# EAGLE schematic micropet_v2 (EAGLE 6.4)

## Sheet 1 of 5: I/O
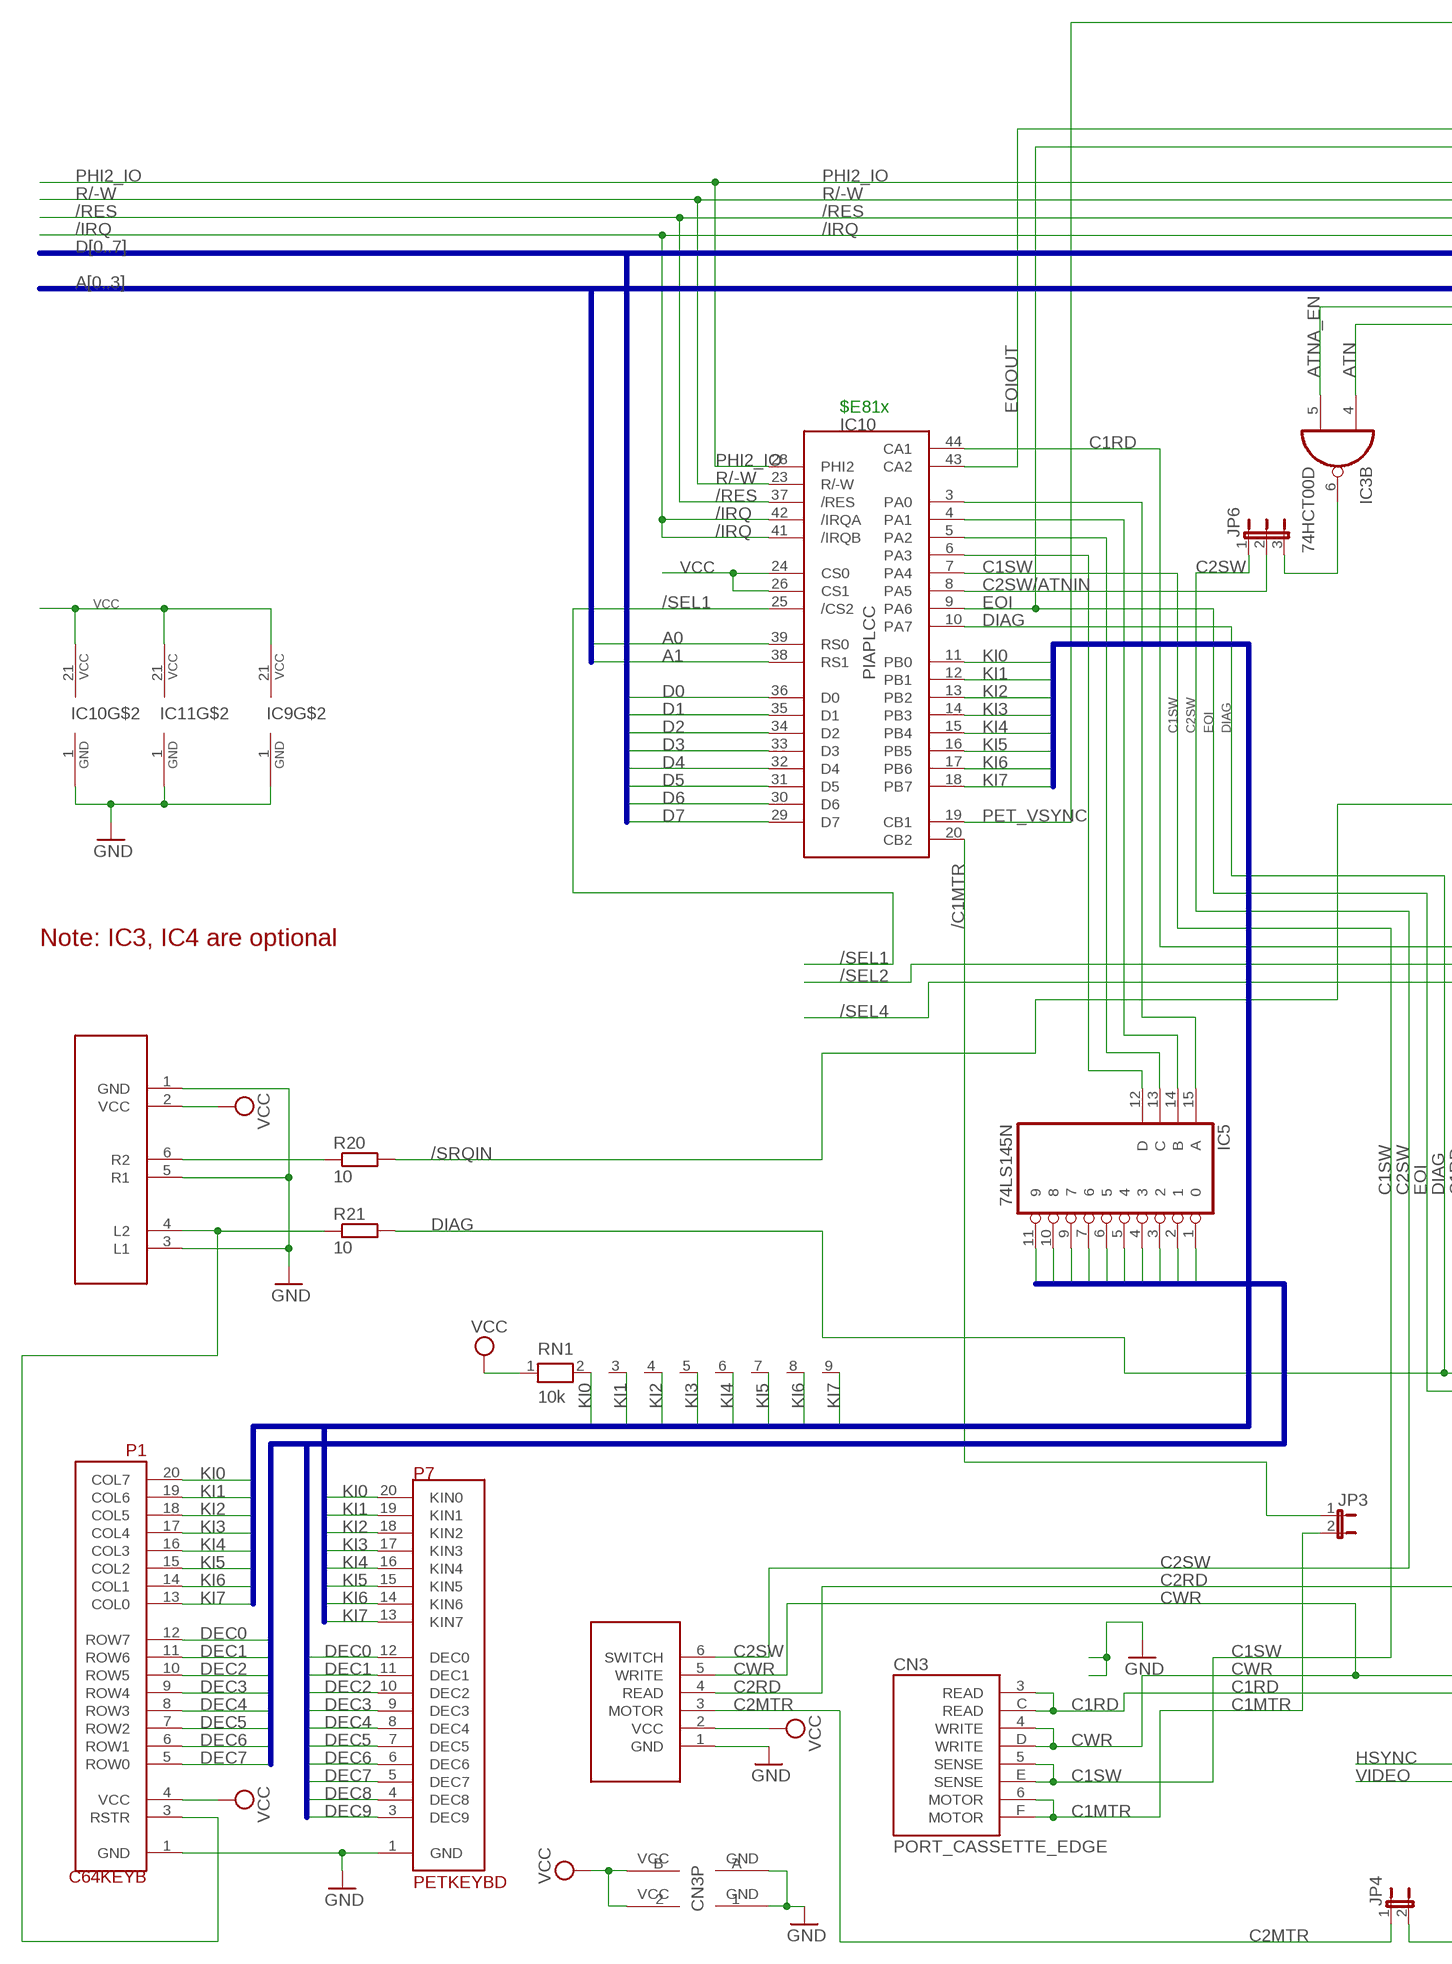
[diagram p0: schematic, sheet 1, part 1 of 2]
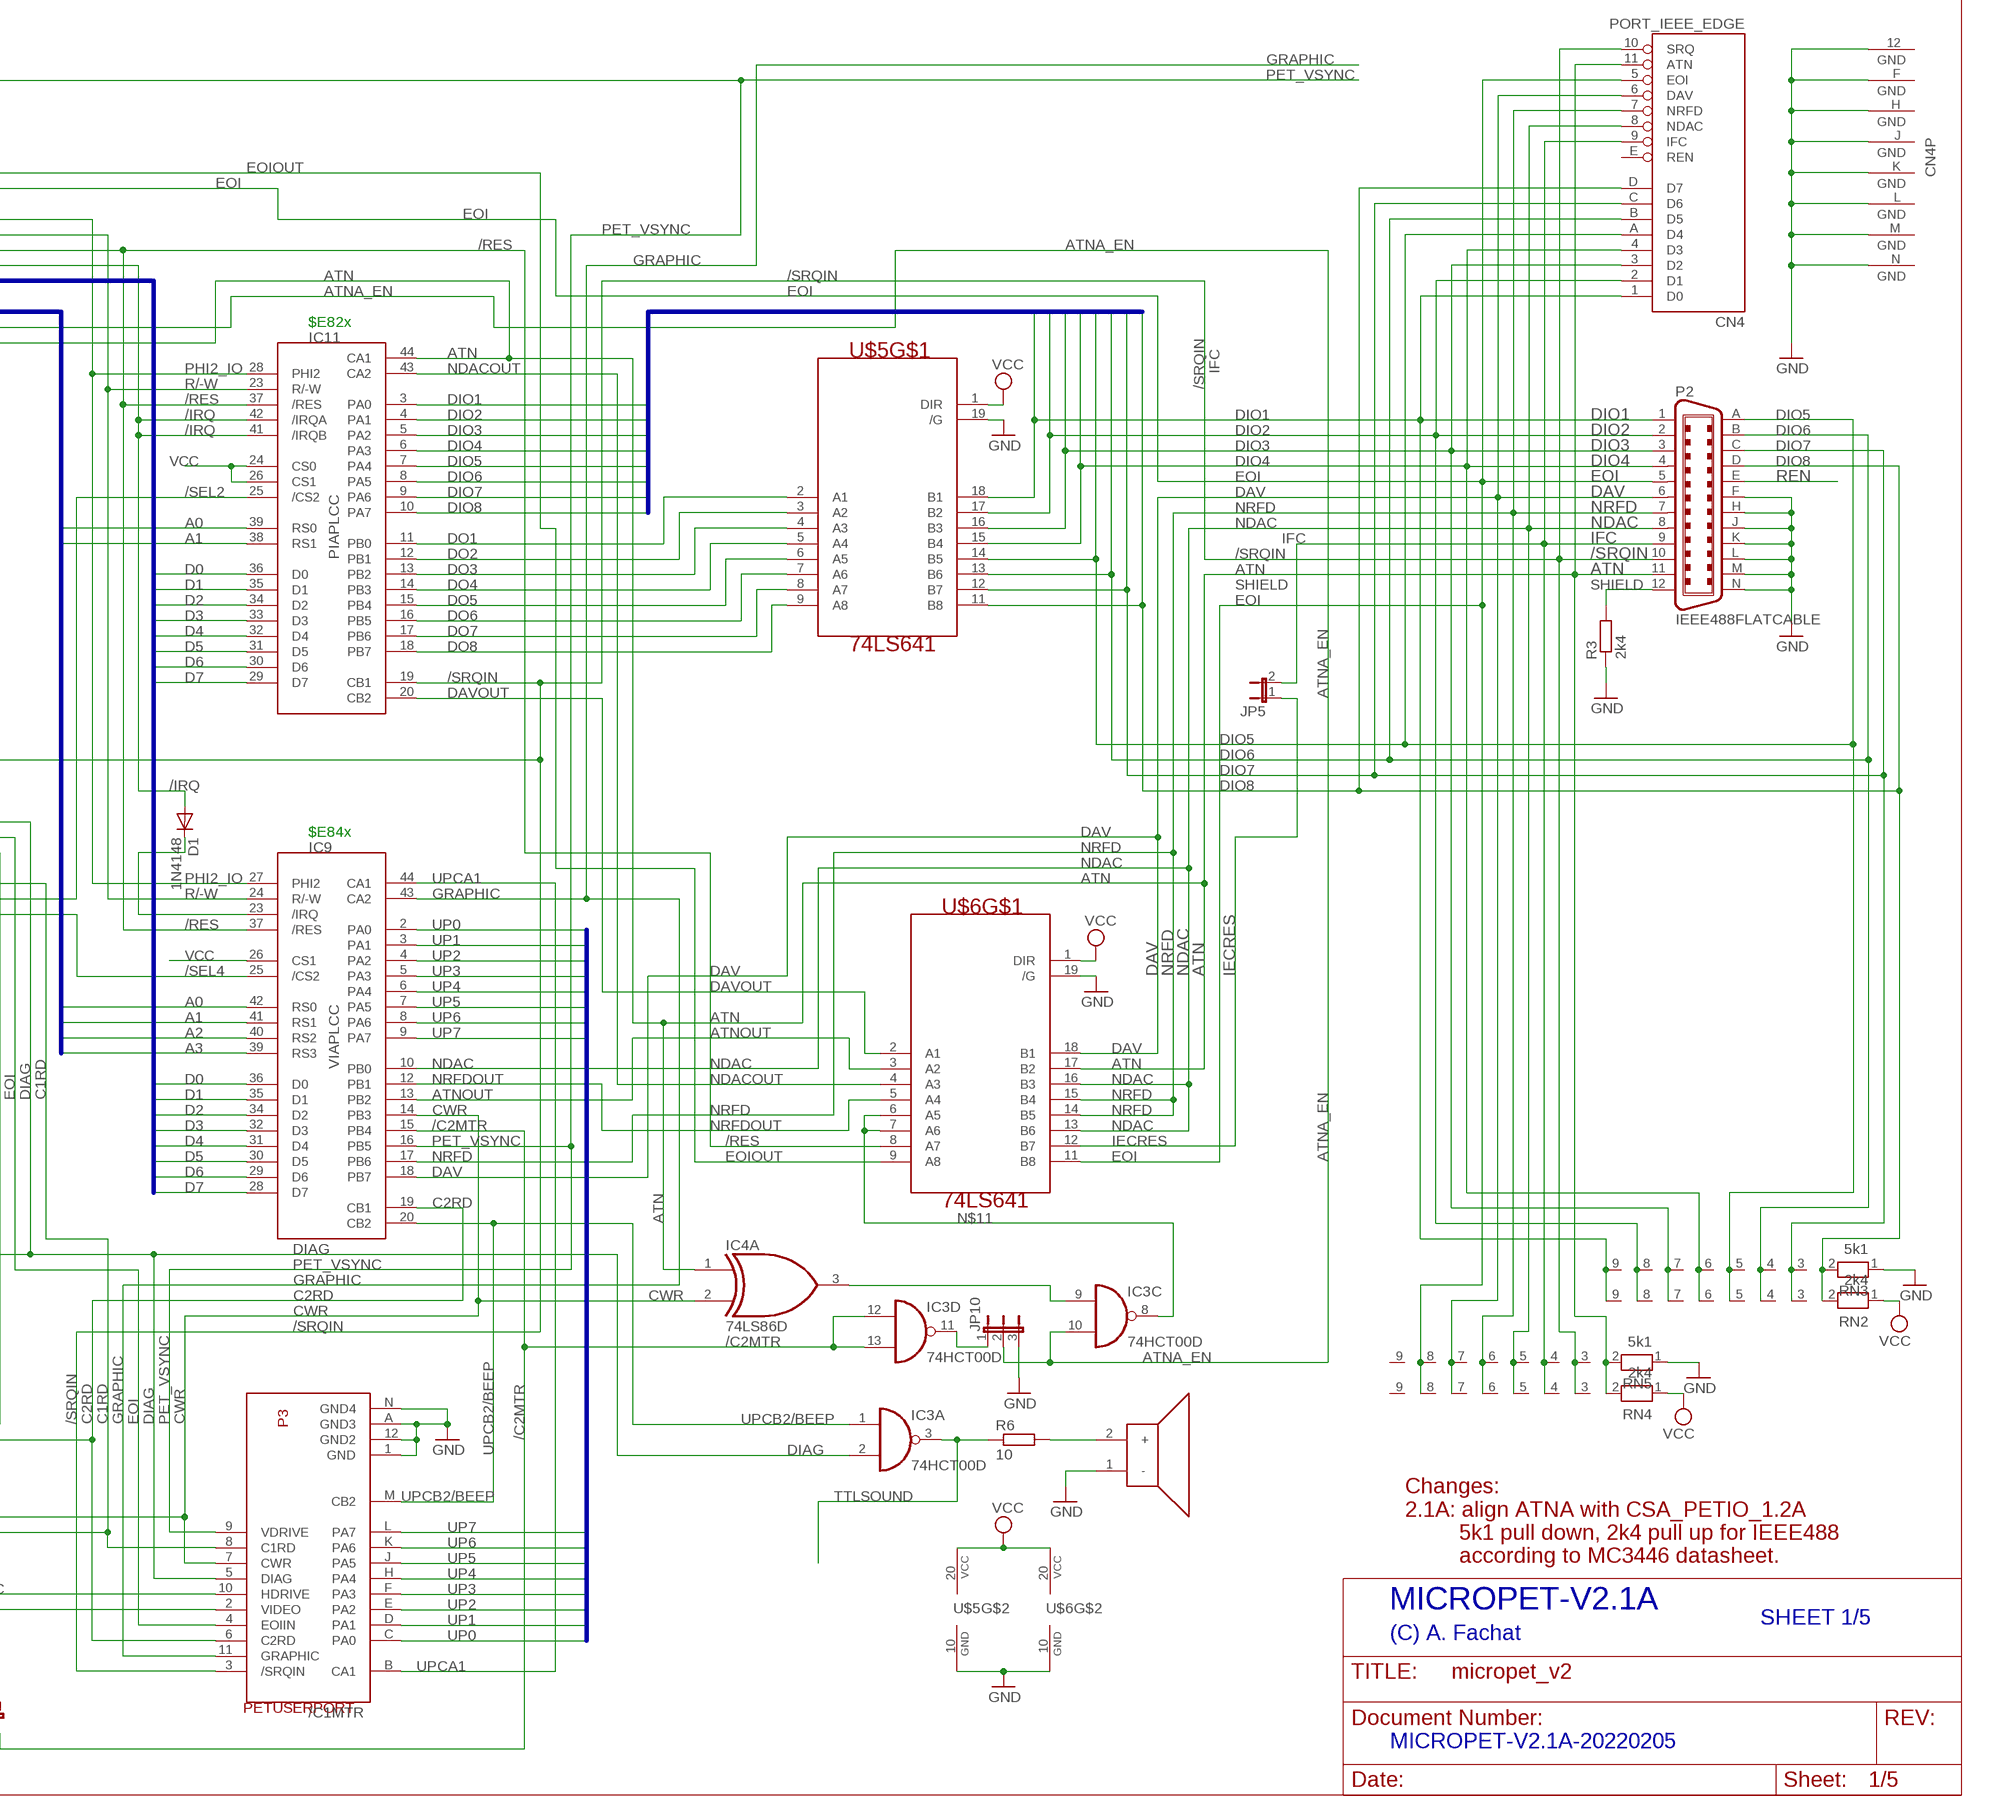
[diagram p1: schematic, sheet 1, part 2 of 2]

### Parts
BEEP1  PIEZOBEEPER  [JP2]
CN3  PORT_CASSETTE_EDGE  [MA156_6-2_KEYED]
CN4  PORT_IEEE_EDGE  [MA156_12-2_IEEE]
D1  1N4148  DIODE-D-5  [D-5]
IC3  74HCT00D  [SO14]
IC4  74LS86D  [SO14]
IC5  74LS145N  [DIL16]
IC9  VIAPLCC  [PLCC44]
IC10  PIAPLCC  [PLCC44]
IC11  PIAPLCC  [PLCC44]
JP3  JP1E  [JP1]
JP4  JP1E  [JP1]
JP5  JP1E  [JP1]
JP6  JP2E  [JP2]
JP10  JP2E  [JP2]
P1  C64KEYB  [C64KEYB]
P2  IEEE488FLATCABLE  [FLAT24]
P3  PETUSERPORT  [FLAT24]
P6  CBMTAPE  [JP6]
P7  PETKEYBD  [C64KEYB]
R3  2k4  R-EU_0207/2V  [0207/2V]
R6  10  R-EU_0207/2V  [0207/2V]
R20  10  R-EU_0207/2V  [0207/2V]
R21  10  R-EU_0207/2V  [0207/2V]
RN1  10k  RN08  [RN-9]
RN2  2k4  RN08  [RN-9]
RN3  5k1  RN08  [RN-9]
RN4  2k4  RN08  [RN-9]
RN5  5k1  RN08  [RN-9]
U$5  74LS641  [DIL20]
U$6  74LS641  [DIL20]
U$11  PETSKEY_EXTRA  [JP6]

### Nets
/C1MTR: IC10.20(CB2) JP3.1
/C2MTR: IC3.12(D:I0) IC3.13(D:I1) IC9.15(PB4) JP4.2
/IRQ: D1.A IC10.41(/IRQB) IC10.42(/IRQA) IC11.41(/IRQB) IC11.42(/IRQA) ; also sheet 2,5
/RES: IC9.37(/RES) IC10.37(/RES) IC11.37(/RES) U$6.8(A7) ; also sheet 2,3,4,5
/SEL1: IC10.25(/CS2) ; also sheet 2
/SEL2: IC11.25(/CS2) ; also sheet 2
/SEL4: IC9.25(/CS2) ; also sheet 2
/SRQIN: CN4.10(SRQ) IC11.19(CB1) P2.10 P3.3(/SRQIN) R20.2 RN4.3 RN5.3
A0: IC9.42(RS0) IC10.39(RS0) IC11.39(RS0) ; also sheet 2
A1: IC9.41(RS1) IC10.38(RS1) IC11.38(RS1) ; also sheet 2
A2: IC9.40(RS2) ; also sheet 2
A3: IC9.39(RS3) ; also sheet 2
ATN: CN4.11(ATN) IC3.4(B:I0) IC4.1(A:I0) IC11.44(CA1) P2.11 RN4.2 RN5.2 U$6.17(B2)
ATNA_EN: IC3.5(B:I1) IC3.10(C:I1) JP10.2
ATNOUT: IC9.13(PB2) U$6.3(A2)
C1MTR: CN3.6(MOTOR) CN3.F(MOTOR) JP3.2
C1RD: CN3.3(READ) CN3.C(READ) IC10.44(CA1) P3.8(C1RD)
C1SW: CN3.5(SENSE) CN3.E(SENSE) IC10.7(PA4)
C2MTR: JP4.1 P6.3(MOTOR)
C2RD: IC9.19(CB1) P3.6(C2RD) P6.4(READ)
C2SW: JP6.1 P6.6(SWITCH)
C2SW/ATNIN: IC10.8(PA5) JP6.2
CWR: CN3.4(WRITE) CN3.D(WRITE) IC4.2(A:I1) IC9.14(PB3) P3.7(CWR) P6.5(WRITE)
D0: IC9.36(D0) IC10.36(D0) IC11.36(D0) ; also sheet 2
D1: IC9.35(D1) IC10.35(D1) IC11.35(D1) ; also sheet 2
D2: IC9.34(D2) IC10.34(D2) IC11.34(D2) ; also sheet 2
D3: IC9.32(D3) IC10.33(D3) IC11.33(D3) ; also sheet 2
D4: IC9.31(D4) IC10.32(D4) IC11.32(D4) ; also sheet 2
D5: IC9.30(D5) IC10.31(D5) IC11.31(D5) ; also sheet 2
D6: IC9.29(D6) IC10.30(D6) IC11.30(D6) ; also sheet 2
D7: IC9.28(D7) IC10.29(D7) IC11.29(D7) ; also sheet 2
DAV: CN4.6(DAV) IC9.18(PB7) P2.6 RN4.7 RN5.7 U$6.18(B1)
DAVOUT: IC11.20(CB2) U$6.2(A1)
DEC0: IC5.1 P1.12(ROW7) P7.12(DEC0)
DEC1: IC5.2 P1.11(ROW6) P7.11(DEC1)
DEC2: IC5.3 P1.10(ROW5) P7.10(DEC2)
DEC3: IC5.4 P1.9(ROW4) P7.9(DEC3)
DEC4: IC5.5 P1.8(ROW3) P7.8(DEC4)
DEC5: IC5.6 P1.7(ROW2) P7.7(DEC5)
DEC6: IC5.7 P1.6(ROW1) P7.6(DEC6)
DEC7: IC5.9 P1.5(ROW0) P7.5(DEC7)
DEC8: IC5.10 P7.4(DEC8)
DEC9: IC5.11 P7.3(DEC9)
DIAG: IC3.2(A:I1) IC10.10(PA7) P3.5(DIAG) R21.2
DIO1: CN4.1(D0) IC11.3(PA0) P2.1 RN2.9 RN3.9 U$5.18(B1)
DIO2: CN4.2(D1) IC11.4(PA1) P2.2 RN2.8 RN3.8 U$5.17(B2)
DIO3: CN4.3(D2) IC11.5(PA2) P2.3 RN2.7 RN3.7 U$5.16(B3)
DIO4: CN4.4(D3) IC11.6(PA3) P2.4 RN2.6 RN3.6 U$5.15(B4)
DIO5: CN4.A(D4) IC11.7(PA4) P2.A RN2.5 RN3.5 U$5.14(B5)
DIO6: CN4.B(D5) IC11.8(PA5) P2.B RN2.4 RN3.4 U$5.13(B6)
DIO7: CN4.C(D6) IC11.9(PA6) P2.C RN2.3 RN3.3 U$5.12(B7)
DIO8: CN4.D(D7) IC11.10(PA7) P2.D RN2.2 RN3.2 U$5.11(B8)
DO1: IC11.11(PB0) U$5.2(A1)
DO2: IC11.12(PB1) U$5.3(A2)
DO3: IC11.13(PB2) U$5.4(A3)
DO4: IC11.14(PB3) U$5.5(A4)
DO5: IC11.15(PB4) U$5.6(A5)
DO6: IC11.16(PB5) U$5.7(A6)
DO7: IC11.17(PB6) U$5.8(A7)
DO8: IC11.18(PB7) U$5.9(A8)
EOI: CN4.5(EOI) IC10.9(PA6) P2.5 P3.4(EOIIN) RN4.8 RN5.8 U$6.11(B8)
EOIOUT: IC10.43(CA2) U$6.9(A8)
GND: BEEP1.1(-) CN3.1(GND) CN3.A(GND) CN4.12(GND) CN4.F(GND) CN4.H(GND) CN4.J(GND) CN4.K(GND) CN4.L(GND) CN4.M(GND) CN4.N(GND) IC9.1(GND) IC10.1(GND) IC11.1(GND) JP10.3 P1.1(GND) P2.F P2.H P2.J P2.K P2.L P2.M P2.N P3.1(GND) P3.12(GND2) P3.A(GND3) P3.N(GND4) P6.1(GND) P7.1(GND) R3.1 RN3.1 RN5.1 U$5.10(GND) U$5.19(/G) U$6.10(GND) U$6.19(/G) U$11.1(GND) U$11.3(L1) U$11.5(R1) ; also sheet 2,3,4,5
GRAPHIC: IC9.43(CA2) P3.11(GRAPHIC) ; also sheet 2
HSYNC: P3.10(HDRIVE) ; also sheet 2,4
IECRES: JP5.1 U$6.12(B7)
IFC: CN4.9(IFC) JP5.2 P2.9 RN4.4 RN5.4
KI0: IC10.11(PB0) P1.20(COL7) P7.20(KIN0) RN1.2
KI1: IC10.12(PB1) P1.19(COL6) P7.19(KIN1) RN1.3
KI2: IC10.13(PB2) P1.18(COL5) P7.18(KIN2) RN1.4
KI3: IC10.14(PB3) P1.17(COL4) P7.17(KIN3) RN1.5
KI4: IC10.15(PB4) P1.16(COL3) P7.16(KIN4) RN1.6
KI5: IC10.16(PB5) P1.15(COL2) P7.15(KIN5) RN1.7
KI6: IC10.17(PB6) P1.14(COL1) P7.14(KIN6) RN1.8
KI7: IC10.18(PB7) P1.13(COL0) P7.13(KIN7) RN1.9
N$1: IC3.9(C:I0) IC4.3(A:O)
N$2: IC3.11(D:O) JP10.1
N$4: BEEP1.2(+) R6.2
N$5: D1.C IC9.23(/IRQ)
N$11: IC3.8(C:O) U$6.6(A5) U$6.7(A6)
N$12: IC3.6(B:O) JP6.3
N$20: IC5.15(A) IC10.3(PA0)
N$21: IC5.14(B) IC10.4(PA1)
N$22: IC5.13(C) IC10.5(PA2)
N$23: IC5.12(D) IC10.6(PA3)
N$43: P1.3(RSTR) R21.1 U$11.4(L2)
N$45: R20.1 U$11.6(R2)
NDAC: CN4.8(NDAC) IC9.10(PB0) P2.8 RN4.5 RN5.5 U$6.13(B6) U$6.16(B3)
NDACOUT: IC11.43(CA2) U$6.4(A3)
NRFD: CN4.7(NRFD) IC9.17(PB6) P2.7 RN4.6 RN5.6 U$6.14(B5) U$6.15(B4)
NRFDOUT: IC9.12(PB1) U$6.5(A4)
PET_VSYNC: IC9.16(PB5) IC10.19(CB1) P3.9(VDRIVE) ; also sheet 2
PHI2_IO: IC9.27(PHI2) IC10.28(PHI2) IC11.28(PHI2) ; also sheet 2
R/-W: IC9.24(R/-W) IC10.23(R/-W) IC11.23(R/-W) ; also sheet 2
REN: P2.E
SHIELD: P2.12 R3.2
TTLSOUND: IC3.3(A:O) R6.1 ; also sheet 4
UP0: IC9.2(PA0) P3.C(PA0)
UP1: IC9.3(PA1) P3.D(PA1)
UP2: IC9.4(PA2) P3.E(PA2)
UP3: IC9.5(PA3) P3.F(PA3)
UP4: IC9.6(PA4) P3.H(PA4)
UP5: IC9.7(PA5) P3.J(PA5)
UP6: IC9.8(PA6) P3.K(PA6)
UP7: IC9.9(PA7) P3.L(PA7)
UPCA1: IC9.44(CA1) P3.B(CA1)
UPCB2/BEEP: IC3.1(A:I0) IC9.20(CB2) P3.M(CB2)
VCC: CN3.2(VCC) CN3.B(VCC) IC9.21(VCC) IC9.26(CS1) IC10.21(VCC) IC10.24(CS0) IC10.26(CS1) IC11.21(VCC) IC11.24(CS0) IC11.26(CS1) P1.4(VCC) P6.2(VCC) RN1.1 RN2.1 RN4.1 U$5.1(DIR) U$5.20(VCC) U$6.1(DIR) U$6.20(VCC) U$11.2(VCC) ; also sheet 2,3,4,5
VIDEO: P3.2(VIDEO) ; also sheet 2,4
Unconnected: CN4.E(REN) IC4.4(B:I0) IC4.5(B:I1) IC4.6(B:O) IC4.8(C:O) IC4.9(C:I0) IC4.10(C:I1) IC4.11(D:O) IC4.12(D:I0) IC4.13(D:I1) RN4.9 RN5.9

### Buses
D[0..7]
A[0..3]
KI[0..7]
UP[0..7]
DEC[0..9]
DIO[1..8]

### Notes on the sheet
- $E82x
- $E81x
- $E84x
- Note: IC3, IC4 are optional
- Changes:
  2.1A: align ATNA with CSA_PETIO_1.2A
           5k1 pull down, 2k4 pull up for IEEE488
           according to MC3446 datasheet.
- MICROPET-V2.1A
- SHEET 1/5
- (C) A. Fachat
- MICROPET-V2.1A-20220205

## Sheet 2 of 5: CPU,RAM,ROM
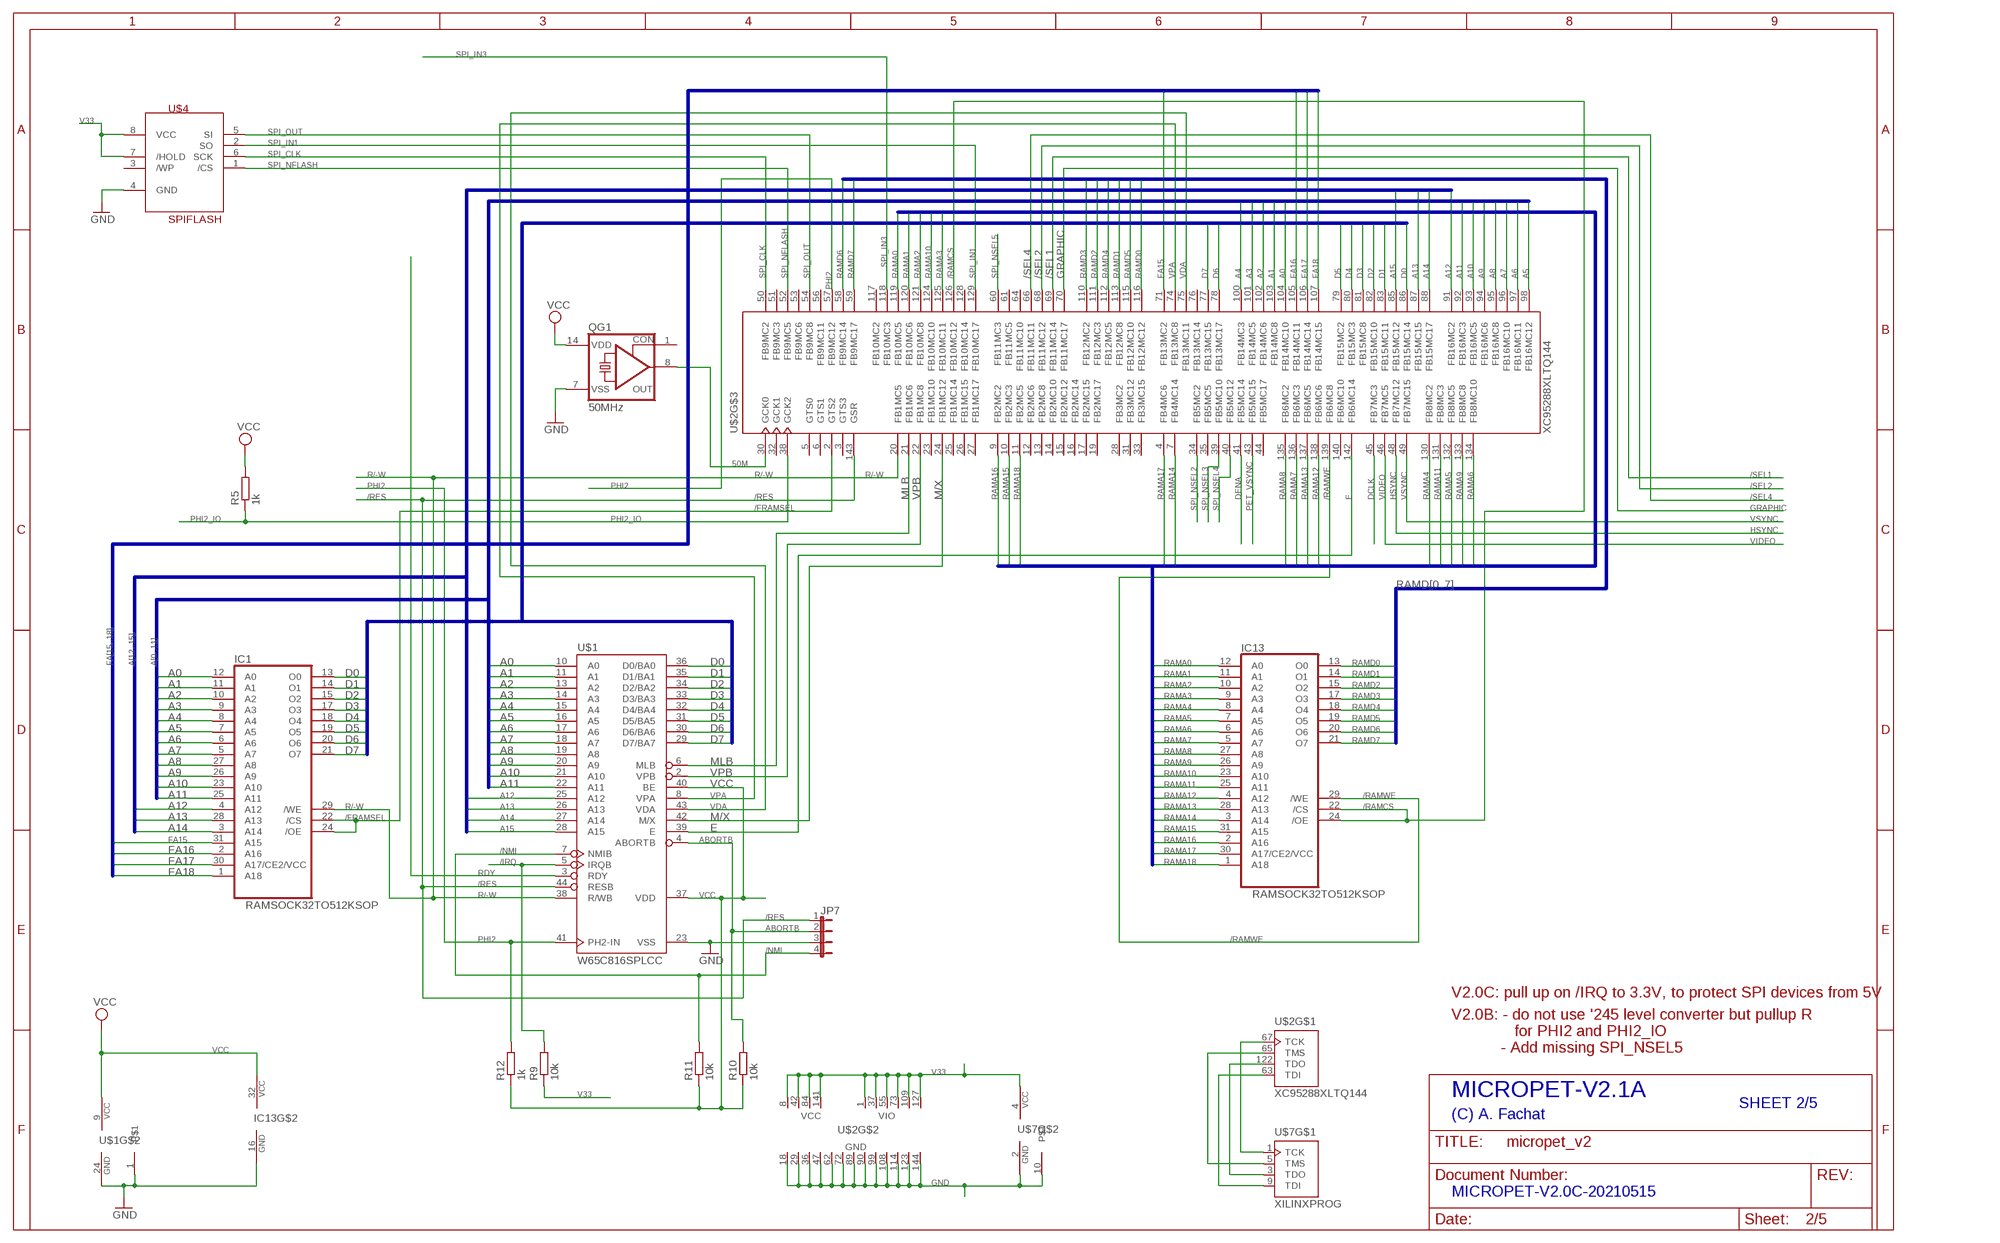
[diagram p2: schematic, sheet 2]

### Parts
IC1  RAMSOCK32TO512KSOP  [SOP32]
IC13  RAMSOCK32TO512KSOP  [SOP32]
JP7  JP4E  [JP4]
QG1  50MHz  CRYSTAL_RES-SG51  [SG51]
R5  1k  R-EU_0207/2V  [0207/2V]
R9  10k  R-EU_0207/2V  [0207/2V]
R10  10k  R-EU_0207/2V  [0207/2V]
R11  10k  R-EU_0207/2V  [0207/2V]
R12  1k  R-EU_0207/2V  [0207/2V]
U$1  W65C816SPLCC  [PLCC44]
U$2  XC95288XLTQ144  [TQFP144]
U$4  SPIFLASH  [DIL08]
U$7  XILINXPROG  [FLAT10BOX]

### Nets
50M: QG1.8(OUT) U$2.30(GCK0)
/FRAMSEL: IC1.22(/CS) IC1.24(/OE) U$2.2(GTS2)
/IRQ: R9.2 U$1.5(IRQB) ; also sheet 1,5
/NMI: JP7.4 R11.2 U$1.7(NMIB)
/RAMCS: IC13.22(/CS) IC13.24(/OE) U$2.126(FB10MC12)
/RAMWE: IC13.29(/WE) U$2.139(FB6MC8)
/RES: JP7.1 U$1.44(RESB) U$2.143(GSR) ; also sheet 1,3,4,5
/SEL1: U$2.69(FB11MC14) ; also sheet 1
/SEL2: U$2.68(FB11MC12) ; also sheet 1
/SEL4: U$2.66(FB11MC11) ; also sheet 1
A0: IC1.12(A0) U$1.10(A0) U$2.104(FB14MC10) ; also sheet 1
A1: IC1.11(A1) U$1.11(A1) U$2.103(FB14MC8) ; also sheet 1
A2: IC1.10(A2) U$1.13(A2) U$2.102(FB14MC6) ; also sheet 1
A3: IC1.9(A3) U$1.14(A3) U$2.101(FB14MC5) ; also sheet 1
A4: IC1.8(A4) U$1.15(A4) U$2.100(FB14MC3)
A5: IC1.7(A5) U$1.16(A5) U$2.98(FB16MC12)
A6: IC1.6(A6) U$1.17(A6) U$2.97(FB16MC11)
A7: IC1.5(A7) U$1.18(A7) U$2.96(FB16MC10)
A8: IC1.27(A8) U$1.19(A8) U$2.95(FB16MC8)
A9: IC1.26(A9) U$1.20(A9) U$2.94(FB16MC6)
A10: IC1.23(A10) U$1.21(A10) U$2.93(FB16MC5)
A11: IC1.25(A11) U$1.22(A11) U$2.92(FB16MC3)
A12: IC1.4(A12) U$1.25(A12) U$2.91(FB16MC2)
A13: IC1.28(A13) U$1.26(A13) U$2.87(FB15MC15)
A14: IC1.3(A14) U$1.27(A14) U$2.88(FB15MC17)
A15: U$1.28(A15) U$2.85(FB15MC12)
ABORTB: JP7.2 R10.2 U$1.4(ABORTB)
D0: IC1.13(O0) U$1.36(D0/BA0) U$2.86(FB15MC14) ; also sheet 1
D1: IC1.14(O1) U$1.35(D1/BA1) U$2.83(FB15MC11) ; also sheet 1
D2: IC1.15(O2) U$1.34(D2/BA2) U$2.82(FB15MC10) ; also sheet 1
D3: IC1.17(O3) U$1.33(D3/BA3) U$2.81(FB15MC8) ; also sheet 1
D4: IC1.18(O4) U$1.32(D4/BA4) U$2.80(FB15MC3) ; also sheet 1
D5: IC1.19(O5) U$1.31(D5/BA5) U$2.79(FB15MC2) ; also sheet 1
D6: IC1.20(O6) U$1.30(D6/BA6) U$2.78(FB13MC17) ; also sheet 1
D7: IC1.21(O7) U$1.29(D7/BA7) U$2.77(FB13MC15) ; also sheet 1
DCLK: U$2.45(FB7MC3) ; also sheet 4
DENA: U$2.41(FB5MC14) ; also sheet 4
E: U$1.39(E) U$2.142(FB6MC14)
FA15: IC1.31(A15) U$2.71(FB13MC2)
FA16: IC1.2(A16) U$2.105(FB14MC11)
FA17: IC1.30(A17/CE2/VCC) U$2.106(FB14MC14)
FA18: IC1.1(A18) U$2.107(FB14MC15)
GND: IC13.16(GND) JP7.3 QG1.7(VSS) U$1.1 U$1.23(VSS) U$1.24(GND) U$2.18(GND) U$2.29(GND) U$2.36(GND) U$2.47(GND) U$2.62(GND) U$2.72(GND) U$2.89(GND) U$2.90(GND) U$2.99(GND) U$2.108(GND) U$2.114(GND) U$2.123(GND) U$2.144(GND) U$4.4(GND) U$7.2(GND) U$7.10 ; also sheet 1,3,4,5
GRAPHIC: U$2.70(FB11MC17) ; also sheet 1
HSYNC: U$2.48(FB7MC12) ; also sheet 1,4
M/X: U$1.42(M/X) U$2.24(FB1MC12)
MLB: U$1.6(MLB) U$2.21(FB1MC6)
PET_VSYNC: U$2.43(FB5MC15) ; also sheet 1
PHI2: R12.2 U$1.41(PH2-IN) U$2.57(FB9MC12)
PHI2_IO: R5.1 U$2.38(GCK2) ; also sheet 1
R/-W: IC1.29(/WE) U$1.38(R/WB) U$2.20(FB1MC5) ; also sheet 1
RAMA0: IC13.12(A0) U$2.119(FB10MC5)
RAMA1: IC13.11(A1) U$2.120(FB10MC6)
RAMA2: IC13.10(A2) U$2.121(FB10MC8)
RAMA3: IC13.9(A3) U$2.125(FB10MC11)
RAMA4: IC13.8(A4) U$2.130(FB8MC2)
RAMA5: IC13.7(A5) U$2.132(FB8MC5)
RAMA6: IC13.6(A6) U$2.134(FB8MC10)
RAMA7: IC13.5(A7) U$2.136(FB6MC3)
RAMA8: IC13.27(A8) U$2.135(FB6MC2)
RAMA9: IC13.26(A9) U$2.133(FB8MC8)
RAMA10: IC13.23(A10) U$2.124(FB10MC10)
RAMA11: IC13.25(A11) U$2.131(FB8MC3)
RAMA12: IC13.4(A12) U$2.138(FB6MC6)
RAMA13: IC13.28(A13) U$2.137(FB6MC5)
RAMA14: IC13.3(A14) U$2.7(FB4MC14)
RAMA15: IC13.31(A15) U$2.10(FB2MC3)
RAMA16: IC13.2(A16) U$2.9(FB2MC2)
RAMA17: IC13.30(A17/CE2/VCC) U$2.4(FB4MC6)
RAMA18: IC13.1(A18) U$2.11(FB2MC5)
RAMD0: IC13.13(O0) U$2.116(FB12MC12)
RAMD1: IC13.14(O1) U$2.113(FB12MC8)
RAMD2: IC13.15(O2) U$2.111(FB12MC3)
RAMD3: IC13.17(O3) U$2.110(FB12MC2)
RAMD4: IC13.18(O4) U$2.112(FB12MC5)
RAMD5: IC13.19(O5) U$2.115(FB12MC10)
RAMD6: IC13.20(O6) U$2.58(FB9MC14)
RAMD7: IC13.21(O7) U$2.59(FB9MC17)
RDY: U$1.3(RDY)
SPI_CLK: U$2.50(FB9MC2) U$4.6(SCK) ; also sheet 5
SPI_IN1: U$2.129(FB10MC17) U$4.2(SO) ; also sheet 5
SPI_IN3: U$2.118(FB10MC3) ; also sheet 5
SPI_NFLASH: U$2.52(FB9MC5) U$4.1(/CS)
SPI_NSEL2: U$2.34(FB5MC2) ; also sheet 5
SPI_NSEL3: U$2.39(FB5MC10) ; also sheet 5
SPI_NSEL4: U$2.40(FB5MC12) ; also sheet 5
SPI_NSEL5: U$2.60(FB11MC3) ; also sheet 5
SPI_OUT: U$2.54(FB9MC8) U$4.5(SI) ; also sheet 5
TCK: U$2.67(TCK) U$7.1(TCK)
TDI: U$2.63(TDI) U$7.9(TDI)
TDO: U$2.122(TDO) U$7.3(TDO)
TMS: U$2.65(TMS) U$7.5(TMS)
V33: R9.1 U$2.1(VIO) U$2.8(VCC) U$2.37(VIO) U$2.42(VCC) U$2.55(VIO) U$2.73(VIO) U$2.84(VCC) U$2.109(VIO) U$2.127(VIO) U$2.141(VCC) U$4.7(/HOLD) U$4.8(VCC) U$7.4(VCC) ; also sheet 3,4,5
VCC: IC13.32(VCC) QG1.14(VDD) R5.2 R10.1 R11.1 R12.1 U$1.9(VCC) U$1.37(VDD) U$1.40(BE) ; also sheet 1,3,4,5
VDA: U$1.43(VDA) U$2.75(FB13MC11)
VIDEO: U$2.46(FB7MC5) ; also sheet 1,4
VPA: U$1.8(VPA) U$2.74(FB13MC8)
VPB: U$1.2(VPB) U$2.22(FB1MC8)
VSYNC: U$2.49(FB7MC15) ; also sheet 4
Unconnected: QG1.1(CON) U$2.3(GTS3) U$2.5(GTS0) U$2.6(GTS1) U$2.12(FB2MC6) U$2.13(FB2MC8) U$2.14(FB2MC10) U$2.15(FB2MC12) U$2.16(FB2MC14) U$2.17(FB2MC15) U$2.19(FB2MC17) U$2.23(FB1MC10) U$2.25(FB1MC14) U$2.26(FB1MC15) U$2.27(FB1MC17) U$2.28(FB3MC2) U$2.31(FB3MC12) U$2.32(GCK1) U$2.33(FB3MC15) U$2.35(FB5MC5) U$2.44(FB5MC17) U$2.51(FB9MC3) U$2.53(FB9MC6) U$2.56(FB9MC11) U$2.61(FB11MC5) U$2.64(FB11MC10) U$2.76(FB13MC14) U$2.117(FB10MC2) U$2.128(FB10MC14) U$2.140(FB6MC10) U$4.3(/WP)

### Buses
A[0..11]
D[0..7]
RAMD[0..7]
RAMA[0..18]
A[12..15]
FA[15..18]

### Notes on the sheet
- V2.0C: pull up on /IRQ to 3.3V, to protect SPI devices from 5V
- V2.0B: - do not use '245 level converter but pullup R 
                for PHI2 and PHI2_IO
             - Add missing SPI_NSEL5
- MICROPET-V2.1A
- SHEET 2/5
- (C) A. Fachat
- MICROPET-V2.0C-20210515

## Sheet 3 of 5: Power
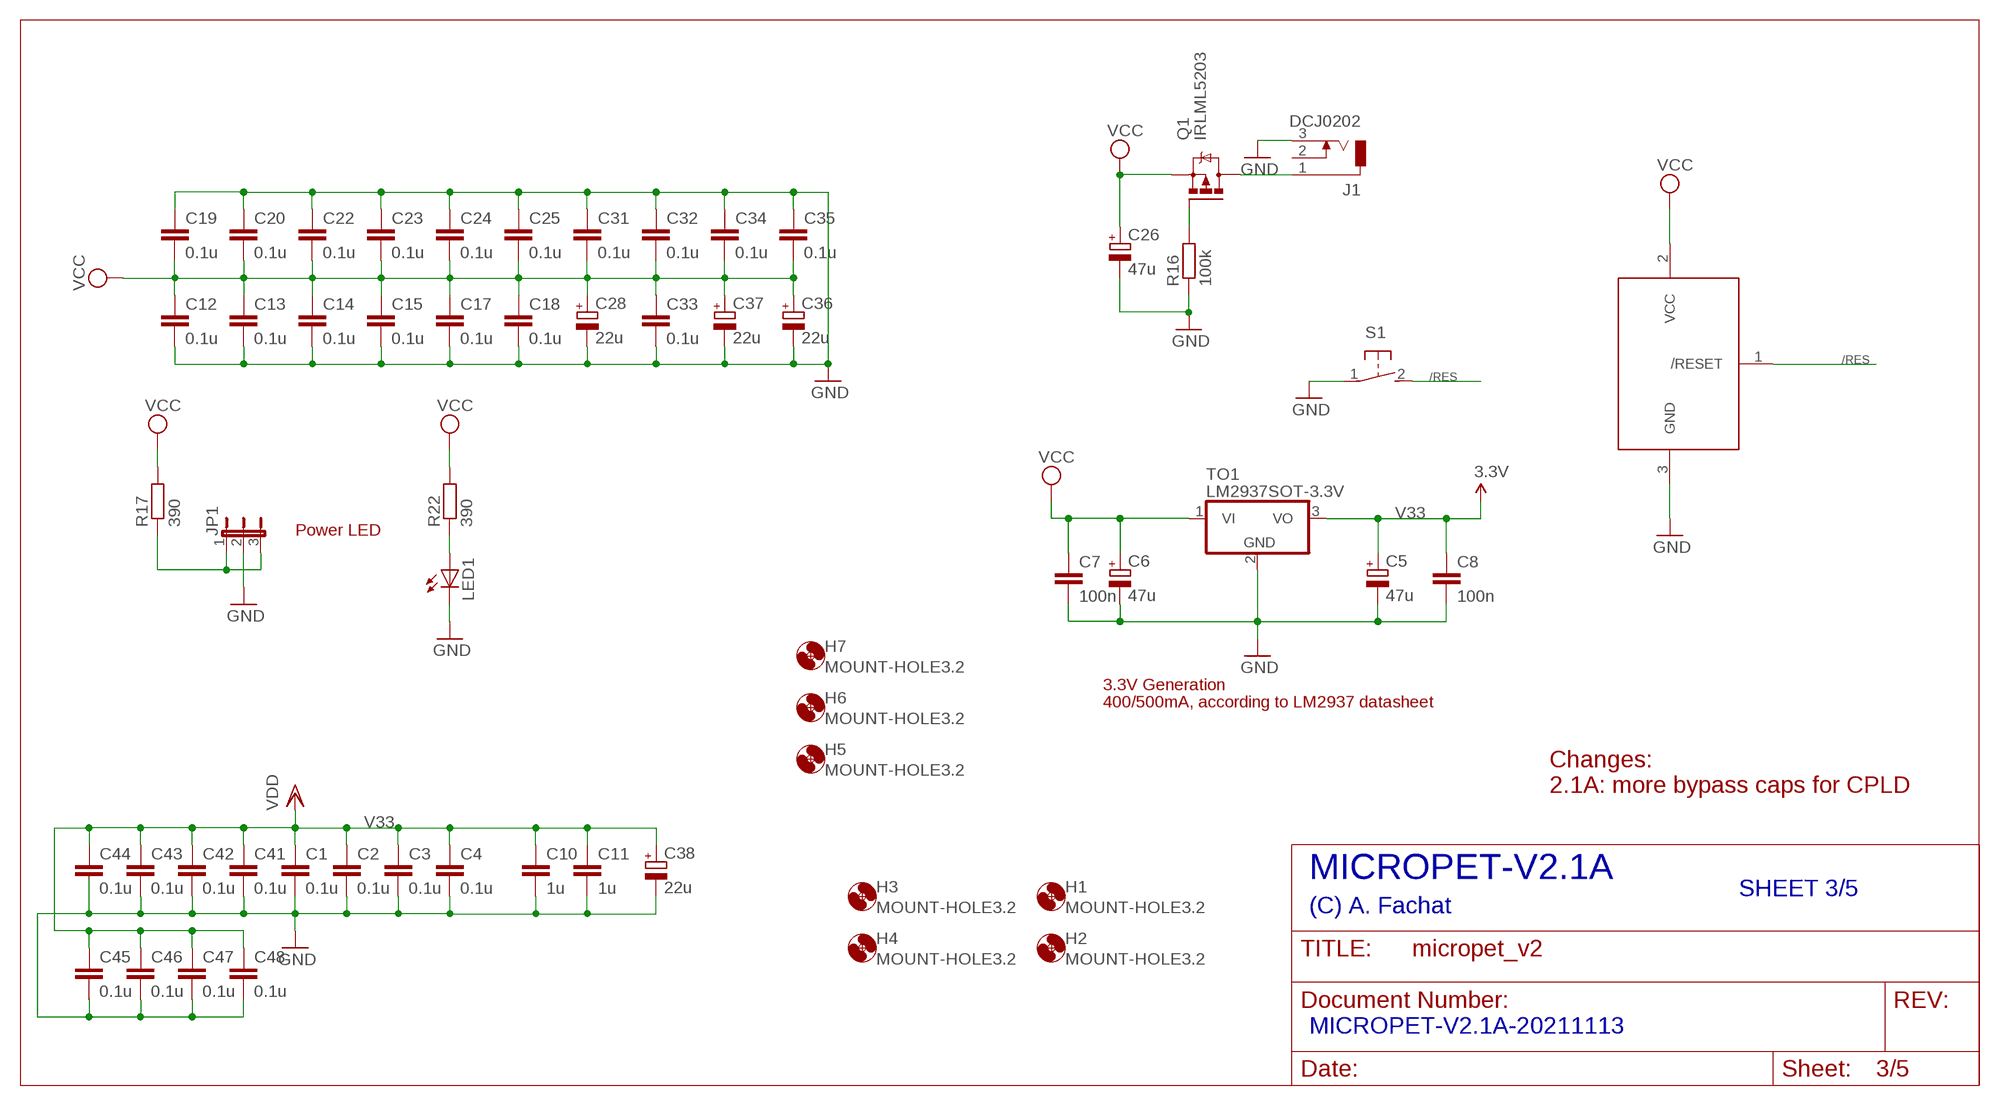
[diagram p3: schematic, sheet 3]

### Parts
C1  0.1u  C-EUC0603  [C0603]
C2  0.1u  C-EUC0603  [C0603]
C3  0.1u  C-EUC0603  [C0603]
C4  0.1u  C-EUC0603  [C0603]
C5  47u  CPOL-EUE5-8.5  [E5-8,5]
C6  47u  CPOL-EUE5-6  [E5-6]
C7  100n  C-EUC0603  [C0603]
C8  100n  C-EUC0603  [C0603]
C10  1u  C-EUC0603  [C0603]
C11  1u  C-EUC0603  [C0603]
C12  0.1u  C-EUC0603  [C0603]
C13  0.1u  C-EUC0603  [C0603]
C14  0.1u  C-EUC0603  [C0603]
C15  0.1u  C-EUC0603  [C0603]
C17  0.1u  C-EUC0603  [C0603]
C18  0.1u  C-EUC0603  [C0603]
C19  0.1u  C-EUC0603  [C0603]
C20  0.1u  C-EUC0603  [C0603]
C22  0.1u  C-EUC0603  [C0603]
C23  0.1u  C-EUC0603  [C0603]
C24  0.1u  C-EUC0603  [C0603]
C25  0.1u  C-EUC0603  [C0603]
C26  47u  CPOL-EUE2.5-6  [E2,5-6]
C28  22u  CPOL-EUE2.5-6  [E2,5-6]
C31  0.1u  C-EUC0603  [C0603]
C32  0.1u  C-EUC0603  [C0603]
C33  0.1u  C-EUC0603  [C0603]
C34  0.1u  C-EUC0603  [C0603]
C35  0.1u  C-EUC0603  [C0603]
C36  22u  CPOL-EUE2.5-6  [E2,5-6]
C37  22u  CPOL-EUE2.5-6  [E2,5-6]
C38  22u  CPOL-EUE2.5-6  [E2,5-6]
C41  0.1u  C-EUC0603  [C0603]
C42  0.1u  C-EUC0603  [C0603]
C43  0.1u  C-EUC0603  [C0603]
C44  0.1u  C-EUC0603  [C0603]
C45  0.1u  C-EUC0603  [C0603]
C46  0.1u  C-EUC0603  [C0603]
C47  0.1u  C-EUC0603  [C0603]
C48  0.1u  C-EUC0603  [C0603]
H1  MOUNT-HOLE3.2  [3,2]
H2  MOUNT-HOLE3.2  [3,2]
H3  MOUNT-HOLE3.2  [3,2]
H4  MOUNT-HOLE3.2  [3,2]
H5  MOUNT-HOLE3.2  [3,2]
H6  MOUNT-HOLE3.2  [3,2]
H7  MOUNT-HOLE3.2  [3,2]
J1  DCJ0202  [DCJ0202]
JP1  JP2E  [JP2]
LED1  LED3MM  [LED3MM]
Q1  IRLML5203  [MICRO3]
R16  100k  R-EU_0207/2V  [0207/2V]
R17  390  R-EU_0207/2V  [0207/2V]
R22  390  R-EU_0207/2V  [0207/2V]
S1  31-XX  [B3F-31XX]
TO1  LM2937SOT-3.3V  LM2937SOT  [SOT223]
U$3  DS1813  [TO92]

### Nets
/RES: S1.2(S) U$3.1(/RESET) ; also sheet 1,2,4,5
GND: C1.2 C2.2 C3.2 C4.2 C5.- C6.- C7.2 C8.2 C10.2 C11.2 C12.2 C13.2 C14.2 C15.2 C17.2 C18.2 C19.1 C20.1 C22.1 C23.1 C24.1 C25.1 C26.- C28.- C31.1 C32.1 C33.2 C34.1 C35.1 C36.- C37.- C38.- C41.2 C42.2 C43.2 C44.2 C45.2 C46.2 C47.2 C48.2 J1.3 JP1.2 LED1.K(C) R16.1 S1.1(P) TO1.2(GND) U$3.3(GND) ; also sheet 1,2,4,5
N$39: J1.1 Q1.3(D)
N$40: Q1.1(G) R16.2
N$41: JP1.1 JP1.3 R17.1
N$46: LED1.A R22.1
V33: C1.1 C2.1 C3.1 C4.1 C5.+ C8.1 C10.1 C11.1 C38.+ C41.1 C42.1 C43.1 C44.1 C45.1 C46.1 C47.1 C48.1 TO1.3(VO) ; supply symbol labelled VDD, 3.3V ; also sheet 2,4,5
VCC: C6.+ C7.1 C12.1 C13.1 C14.1 C15.1 C17.1 C18.1 C19.2 C20.2 C22.2 C23.2 C24.2 C25.2 C26.+ C28.+ C31.2 C32.2 C33.1 C34.2 C35.2 C36.+ C37.+ Q1.2(S) R17.2 R22.2 TO1.1(VI) U$3.2(VCC) ; also sheet 1,2,4,5
Unconnected: J1.2

### Notes on the sheet
- Power LED
- 3.3V Generation
- 400/500mA, according to LM2937 datasheet
- Changes:
  2.1A: more bypass caps for CPLD
- MICROPET-V2.1A
- SHEET 3/5
- (C) A. Fachat
- MICROPET-V2.1A-20211113

## Sheet 4 of 5: A/V Out
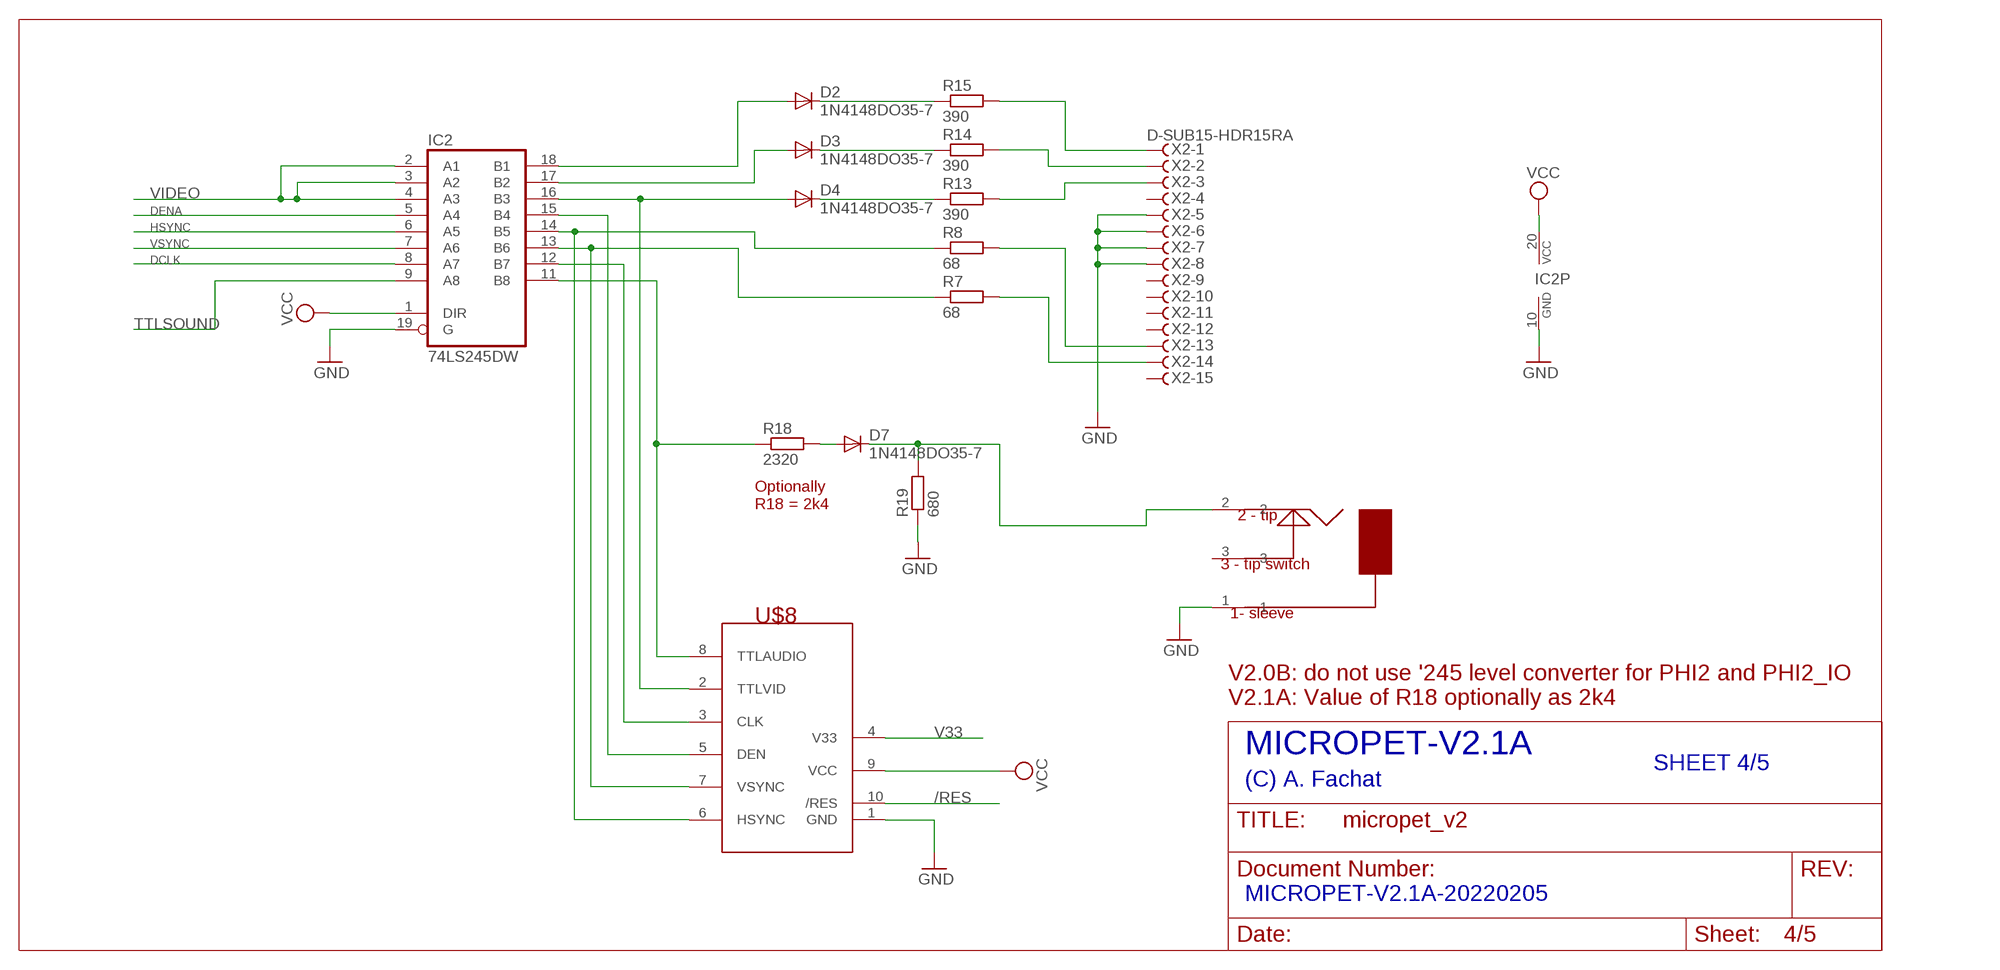
[diagram p4: schematic, sheet 4]

### Parts
D2  1N4148DO35-7  [DO35-7]
D3  1N4148DO35-7  [DO35-7]
D4  1N4148DO35-7  [DO35-7]
D7  1N4148DO35-7  [DO35-7]
IC2  74LS245DW  [SO20W]
R7  68  R-EU_0204/2V  [0204V]
R8  68  R-EU_0204/2V  [0204V]
R13  390  R-EU_0204/2V  [0204V]
R14  390  R-EU_0204/2V  [0204V]
R15  390  R-EU_0204/2V  [0204V]
R18  2320  R-EU_0204/2V  [0204V]
R19  680  R-EU_0204/2V  [0204V]
U$8  MONOVIDAUDIO  [FLAT10RIB]
U$10  MONOAUDIOB  [CUI_MJ-3502-B]
X2  D-SUB15-HDR15RA  [HDR15RA]

### Nets
/RES: U$8.10(/RES) ; also sheet 1,2,3,5
DCLK: IC2.8(A7) ; also sheet 2
DENA: IC2.5(A4) ; also sheet 2
GND: IC2.10(GND) IC2.19(G) R19.1 U$8.1(GND) U$10.1 X2.5 X2.6 X2.7 X2.8 ; also sheet 1,2,3,5
HSYNC: IC2.6(A5) ; also sheet 1,2
N$3: IC2.11(B8) R18.1 U$8.8(TTLAUDIO)
N$6: D2.A IC2.18(B1)
N$7: IC2.13(B6) R7.1 U$8.7(VSYNC)
N$14: IC2.12(B7) U$8.3(CLK)
N$17: R15.2 X2.1
N$18: R14.2 X2.2
N$19: R13.2 X2.3
N$24: R8.2 X2.13
N$25: R7.2 X2.14
N$26: IC2.14(B5) R8.1 U$8.6(HSYNC)
N$27: IC2.15(B4) U$8.5(DEN)
N$28: D4.A IC2.16(B3) U$8.2(TTLVID)
N$31: D2.C R15.1
N$32: D3.C R14.1
N$33: D4.C R13.1
N$42: D7.A R18.2
N$44: D7.C R19.2 U$10.2
N$50: D3.A IC2.17(B2)
TTLSOUND: IC2.9(A8) ; also sheet 1
V33: U$8.4(V33) ; also sheet 2,3,5
VCC: IC2.1(DIR) IC2.20(VCC) U$8.9(VCC) ; also sheet 1,2,3,5
VIDEO: IC2.2(A1) IC2.3(A2) IC2.4(A3) ; also sheet 1,2
VSYNC: IC2.7(A6) ; also sheet 2
Unconnected: U$10.3 X2.4 X2.9 X2.10 X2.11 X2.12 X2.15

### Notes on the sheet
- Optionally
  R18 = 2k4
- V2.0B: do not use '245 level converter for PHI2 and PHI2_IO
  V2.1A: Value of R18 optionally as 2k4
- MICROPET-V2.1A
- SHEET 4/5
- (C) A. Fachat
- MICROPET-V2.1A-20220205

## Sheet 5 of 5: USB
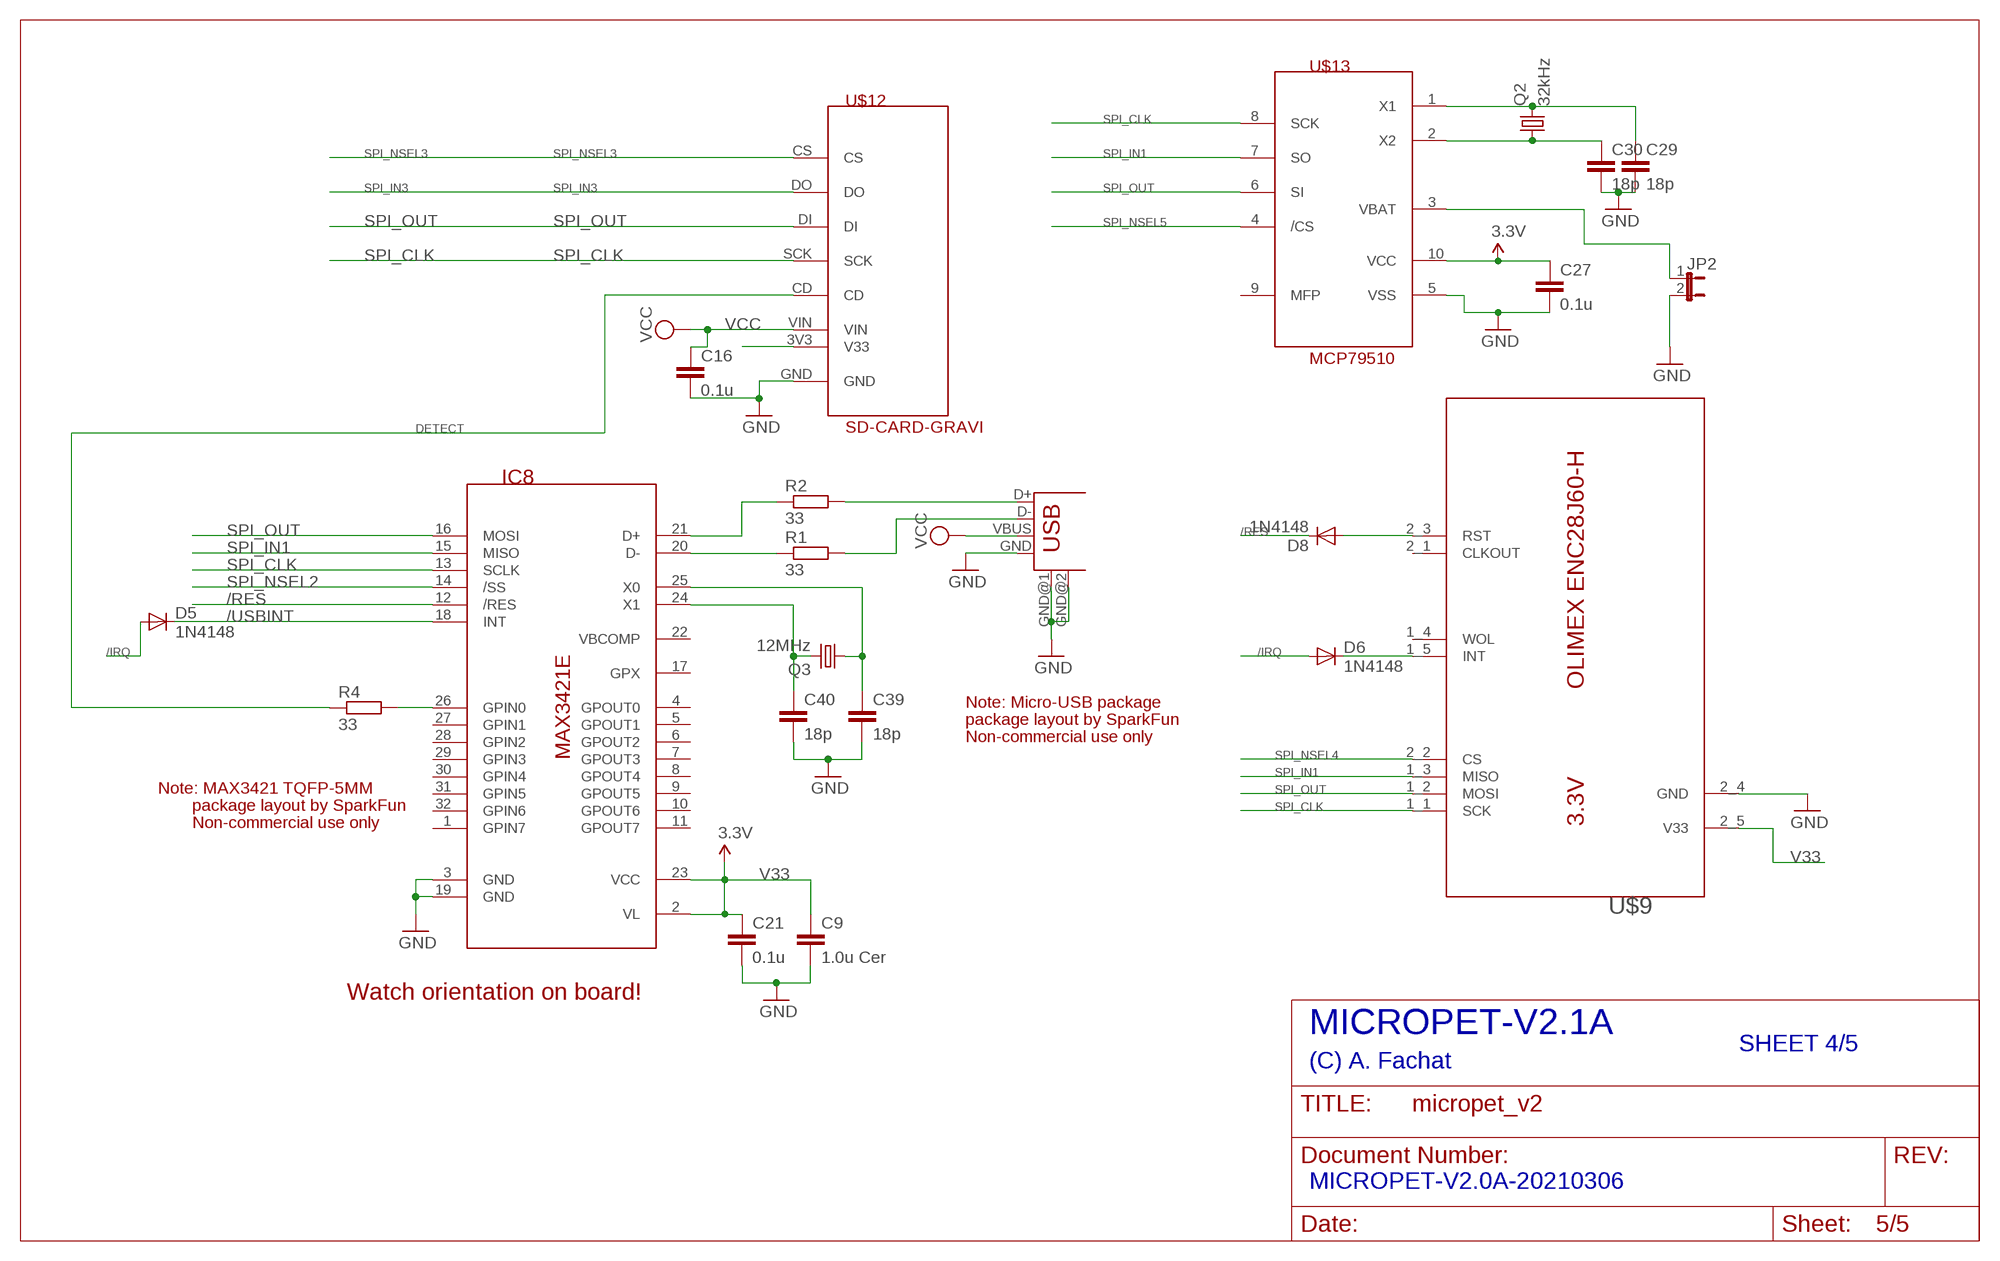
[diagram p5: schematic, sheet 5]

### Parts
C9  1.0u Cer  C-EUC0603  [C0603]
C16  0.1u  C-EUC0603  [C0603]
C21  0.1u  C-EUC0603  [C0603]
C27  0.1u  C-EUC0603  [C0603]
C29  18p  C-EUC0603  [C0603]
C30  18p  C-EUC0603  [C0603]
C39  18p  C-EUC0603  [C0603]
C40  18p  C-EUC0603  [C0603]
D5  1N4148  DIODE-D-5  [D-5]
D6  1N4148  DIODE-D-5  [D-5]
D8  1N4148  DIODE-D-5  [D-5]
IC8  MAX3421E  [TQFP32-5MM]
JP2  JP1E  [JP1]
Q2  32kHz  CRYSTALTC26H  [TC26H]
Q3  12MHz  CRYSTALHC49S  [HC49/S]
R1  33  R-EU_0204/7  [0204/7]
R2  33  R-EU_0204/7  [0204/7]
R4  33  R-EU_0204/7  [0204/7]
U$9  ETHOLIENC  [ETHOLIENC]
U$12  SD-CARD-GRAVI  [GRAVITECH-SDCARD]
U$13  MCP79510  [MSOP10]
USB1  USB-A-H  [USB-A-H]

### Nets
12MHZ: C40.1 IC8.24(X1) Q3.2
/IRQ: D5.A D6.A ; also sheet 1,2
/RES: D8.C IC8.12(/RES) ; also sheet 1,2,3,4
/USBINT: D5.C IC8.18(INT)
DETECT: R4.1 U$12.CD
FOO: U$12.3V3(V33)
GND: C9.2 C16.2 C21.2 C27.2 C29.2 C30.2 C39.2 C40.2 IC8.3(GND) IC8.19(GND) JP2.2 U$9.2_4(GND) U$12.GND U$13.5(VSS) USB1.GND USB1.GND@1(GND) USB1.GND@2(GND) ; also sheet 1,2,3,4
N$13: IC8.20(D-) R1.1
N$15: IC8.21(D+) R2.1
N$29: JP2.1 U$13.3(VBAT)
N$30: C29.1 Q2.2 U$13.1(X1)
N$34: D6.C U$9.1_5(INT)
N$35: R2.2 USB1.D+
N$36: R1.2 USB1.D-
N$37: IC8.26(GPIN0) R4.2
N$47: C30.1 Q2.1 U$13.2(X2)
N$48: D8.A U$9.2_3(RST)
N$49: C39.1 IC8.25(X0) Q3.1
SPI_CLK: IC8.13(SCLK) U$9.1_1(SCK) U$12.SCK U$13.8(SCK) ; also sheet 2
SPI_IN1: IC8.15(MISO) U$9.1_3(MISO) U$13.7(SO) ; also sheet 2
SPI_IN3: U$12.DO ; also sheet 2
SPI_NSEL2: IC8.14(/SS) ; also sheet 2
SPI_NSEL3: U$12.CS ; also sheet 2
SPI_NSEL4: U$9.2_2(CS) ; also sheet 2
SPI_NSEL5: U$13.4(/CS) ; also sheet 2
SPI_OUT: IC8.16(MOSI) U$9.1_2(MOSI) U$12.DI U$13.6(SI) ; also sheet 2
V33: C9.1 C21.1 C27.1 IC8.2(VL) IC8.23(VCC) U$9.2_5(V33) U$13.10(VCC) ; supply symbol labelled 3.3V ; also sheet 2,3,4
VCC: C16.1 U$12.VIN USB1.VBUS ; also sheet 1,2,3,4
Unconnected: IC8.1(GPIN7) IC8.4(GPOUT0) IC8.5(GPOUT1) IC8.6(GPOUT2) IC8.7(GPOUT3) IC8.8(GPOUT4) IC8.9(GPOUT5) IC8.10(GPOUT6) IC8.11(GPOUT7) IC8.17(GPX) IC8.22(VBCOMP) IC8.27(GPIN1) IC8.28(GPIN2) IC8.29(GPIN3) IC8.30(GPIN4) IC8.31(GPIN5) IC8.32(GPIN6) U$9.1_4(WOL) U$9.2_1(CLKOUT) U$13.9(MFP)

### Notes on the sheet
- Note: Micro-USB package
- package layout by SparkFun
- Non-commercial use only
- Note: MAX3421 TQFP-5MM
- package layout by SparkFun
- Non-commercial use only
- Watch orientation on board!
- MICROPET-V2.1A
- SHEET 4/5
- (C) A. Fachat
- MICROPET-V2.0A-20210306

## Power pins joined to a net without a drawn wire
GND: IC1.16(GND) IC3.7(P:GND) IC4.7(P:GND) IC5.8(GND)
VCC: IC1.32(VCC) IC3.14(P:VCC) IC4.14(P:VCC) IC5.16(VCC)

## Library data of the parts
BEEP1 = csa:PIEZOBEEPER
C1-C4 C7-C25 C27 C29-C35 C39-C48 = rcl:C-EU: CAPACITOR, European symbol
C5 C6 C26 C28 C36-C38 = rcl:CPOL-EU: POLARIZED CAPACITOR, European symbol
CN3 = commodore:PORT_CASSETTE_EDGE
CN4 = commodore:PORT_IEEE_EDGE: IEEE connector for various Commodore computers, PET/CBM type, edge version
D1 D5 D6 D8 = diode:DIODE-: DIODE
D2-D4 D7 = diode:1N4148: DIODE high speed (Philips)
H1-H7 = holes:MOUNT-HOLE: MOUNTING HOLE with drill center marker
IC1 IC13 = csa:RAMSOCK32TO512K
IC2 = 74xx-eu:74*245: Octal BUS TRANSCEIVER, 3-state
IC3 = 74xx-eu:74*00: Quad 2-input NAND gate
IC4 = 74xx-us:74*86: Quad 2-input EXCLUSIV-OR (XOR) gate
IC5 = 74xx-eu:74*145: BCD to decimal DECODER/DRIVER
IC8 = csa:MAX3421E
IC9 = csa:VIA
IC10 IC11 = csa:PIA
J1 = con-jack:DCJ0202: DC POWER JACK Source: DCJ0202.pdf; OC_FARNELL: unknown; OC_NEWARK: unknown
JP1 JP6 JP10 = jumper:JP2E: JUMPER
JP2-JP5 = jumper:JP1E: JUMPER
JP7 = jumper:JP4E: JUMPER
LED1 = led:LED: LED OSRAM: - CHIPLED LG R971, LG N971, LY N971, LG Q971, LY Q971, LO R971, LY R971 LH N974, LH R974 LS Q976, LO Q976, LY Q976 LO Q996 - Hyper CHIPLED LW Q18S LB Q993, LB Q99A, LB R99A - SideLED LS A670, LO A670, LY A670, LG A670, LP A670 LB A673, LV A673, LT A673, LW A673 LH A674 LY A675 LS A676, LA A676, LO A676, LY A676, LW A676 LS A679, LY A679, LG A679 - Hyper Micro SIDELED® LS Y876, LA Y876, LO Y876, LY Y876 LT Y87S - SmartLED LW L88C, LW L88S LB L89C, LB L89S, LG L890 LS L89K, LO L89K, LY L89K LS L896, LA L896, LO L896, LY L896 - TOPLED LS T670, LO T670, LY T670, LG T670, LP T670 LSG T670, LSP T670, LSY T670, LOP T670, LYG T670 LG T671, LOG T671, LSG T671 LB T673, LV T673, LT T673, LW T673 LH T674 LS T676, LA T676, LO T676, LY T676, LB T676, LH T676, LSB T676, LW T676 LB T67C, LV T67C, LT T67C, LS T67K, LO T67K, LY T67K, LW E67C LS E67B, LA E67B, LO E67B, LY E67B, LB E67C, LV E67C, LT E67C LW T67C LS T679, LY T679, LG T679 LS T770, LO T770, LY T770, LG T770, LP T770 LB T773, LV T773, LT T773, LW T773 LH T774 LS E675, LA E675, LY E675, LS T675 LS T776, LA T776, LO T776, LY T776, LB T776 LHGB T686 LT T68C, LB T68C - Hyper Mini TOPLED® LB M676 - Mini TOPLED Santana® LG M470 LS M47K, LO M47K, LY M47K Source: http://www.osram.convergy.de LUXEON: - LUMILED® LXK2-PW12-R00, LXK2-PW12-S00, LXK2-PW14-U00, LXK2-PW14-V00 LXK2-PM12-R00, LXK2-PM12-S00, LXK2-PM14-U00 LXK2-PE12-Q00, LXK2-PE12-R00, LXK2-PE12-S00, LXK2-PE14-T00, LXK2-PE14-U00 LXK2-PB12-K00, LXK2-PB12-L00, LXK2-PB12-M00, LXK2-PB14-N00, LXK2-PB14-P00, LXK2-PB14-Q00 LXK2-PR12-L00, LXK2-PR12-M00, LXK2-PR14-Q00, LXK2-PR14-R00 LXK2-PD12-Q00, LXK2-PD12-R00, LXK2-PD12-S00 LXK2-PH12-R00, LXK2-PH12-S00 LXK2-PL12-P00, LXK2-PL12-Q00, LXK2-PL12-R00 Source: www.luxeon.com KINGBRIGHT: KA-3528ASYC Source: www.kingbright.com
P1 = csa:C64KEYB
P2 = csa:IEEE488
P3 = csa:PETUSERPORT
P6 = csa:CBMTAPE
P7 = csa:PETKEYBD
Q1 = transistor-power:IRLML5203: HEXFET P-Channel Power MOSFET
Q2 = crystal:CRYSTAL: CRYSTAL; OC_FARNELL: unknown; OC_NEWARK: unknown
Q3 = crystal:CRYSTAL: CRYSTAL; OC_FARNELL: 1667008; OC_NEWARK: unknown
QG1 = crystal:CRYSTAL_RES-: CRYSTAL RESONATOR; OC_FARNELL: unknown; OC_NEWARK: unknown
R1-R22 = rcl:R-EU_: RESISTOR, European symbol
RN1-RN5 = resistor-net:RN08: RESISTOR NETWORK
S1 = switch-omron:31-XX: OMRON SWITCH; MPN: B3F-3100; OC_FARNELL: 959704; OC_NEWARK: 36M3582
TO1 = csa:LM2937
U$1 = csa:W65C816S
U$2 = csa:XC95288XL
U$3 = csa:DS1813
U$4 = csa:SPIFLASH
U$5 U$6 = csa:74LS641
U$7 = csa:XILINXPROG
U$8 = csa:MONOVIDAUDIO
U$9 = csa:ETHOLIENC
U$10 = csa:MONOAUDIO
U$11 = csa:PETSKEY_EXTRA
U$12 = csa:SD-CARD-GRAVI
U$13 = csa:MCP79510
USB1 = con-usb-2:USB: USB Connectors
X2 = con-thomas-betts:D-SUB15-: D-Subminiatur Connector Source: Electronioc Interconnects European Edition 1998; OC_FARNELL: unknown; OC_NEWARK: unknown